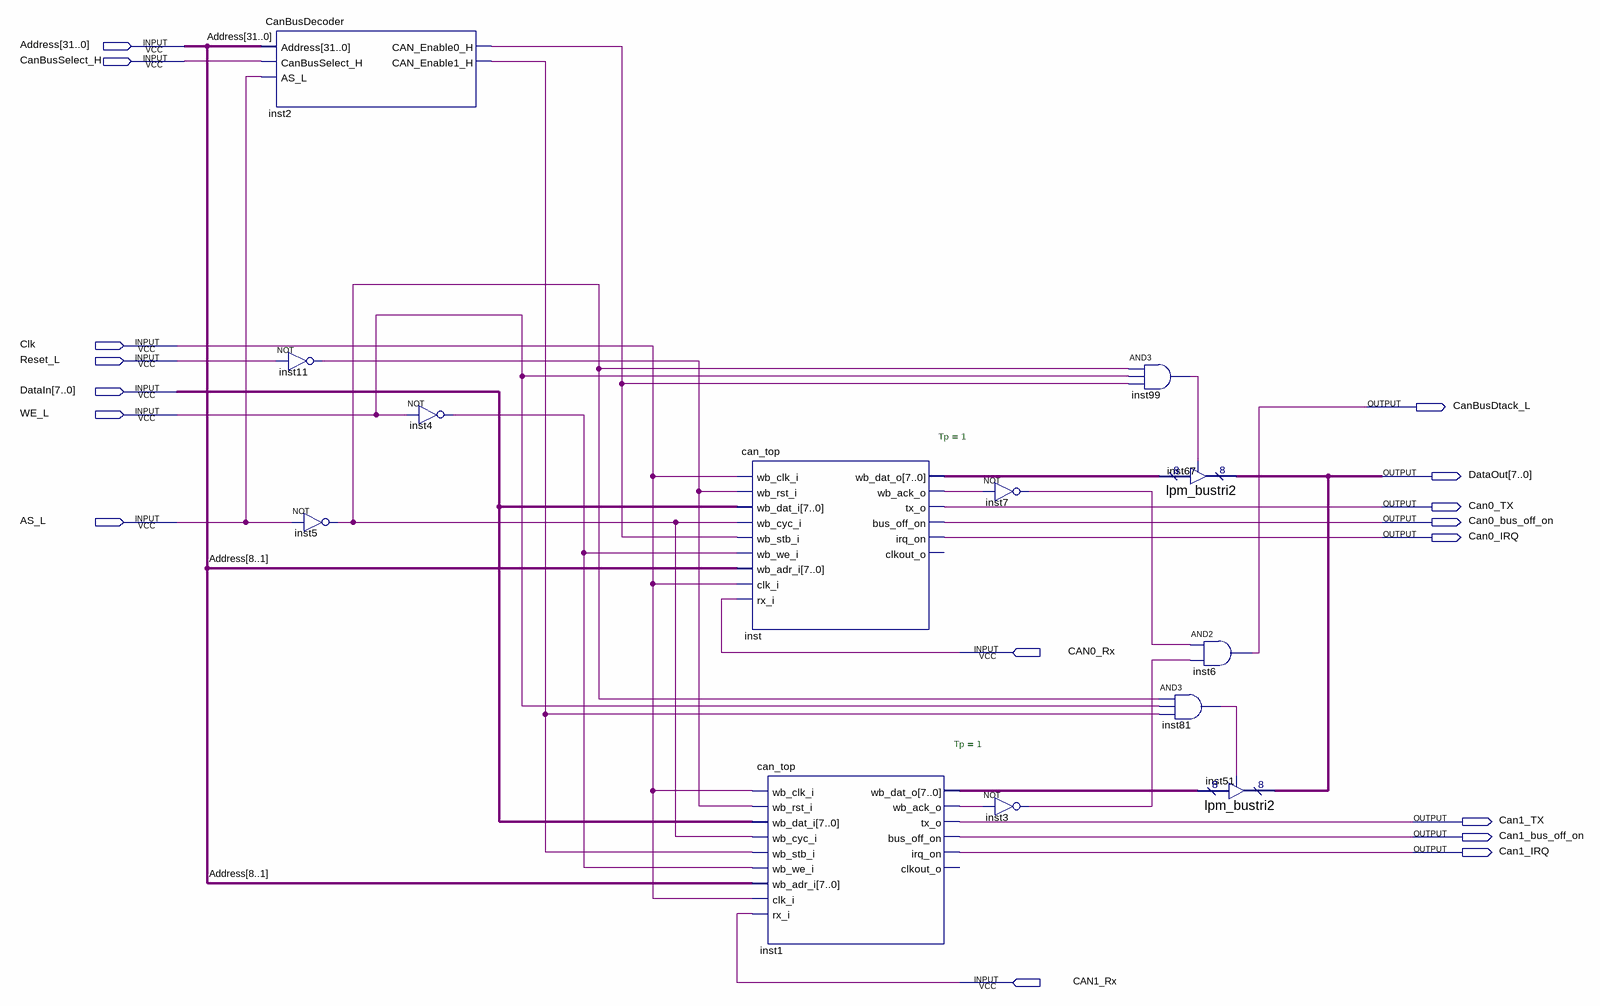
[diagram p0: schematic sheet]
// Quartus schematic CanBus.bdf as structural Verilog: 13 symbols, 17 pins
module CanBus (
  input  [31:0] Address,
  input  CanBusSelect_H,
  input  Clk,
  input  Reset_L,
  input  [7:0] DataIn,
  input  WE_L,
  input  AS_L,
  input  CAN0_Rx,
  input  CAN1_Rx,
  output CanBusDtack_L,
  output [7:0] DataOut,
  output Can0_TX,
  output Can0_bus_off_on,
  output Can0_IRQ,
  output Can1_TX,
  output Can1_bus_off_on,
  output Can1_IRQ
);

  wire inst1_wb_ack_o, inst2_can_enable0_h, inst2_can_enable1_h, inst3_out, inst4_out, inst5_out, inst7_out,
       inst11_out, inst81_out, inst99_out, inst_wb_ack_o;
  wire [7:0] inst1_wb_dat_o, inst_wb_dat_o;

  CanBusDecoder inst2 (
    .Address(Address), .CanBusSelect_H(CanBusSelect_H), .AS_L(AS_L), .CAN_Enable0_H(inst2_can_enable0_h),
    .CAN_Enable1_H(inst2_can_enable1_h));
  not inst11 (inst11_out, Reset_L);
  not inst5 (inst5_out, AS_L);
  not inst4 (inst4_out, WE_L);
  can_top #(.Tp(1)) inst (
    .wb_clk_i(Clk), .wb_rst_i(inst11_out), .wb_dat_i(DataIn), .wb_cyc_i(inst5_out),
    .wb_stb_i(inst2_can_enable0_h), .wb_we_i(inst4_out), .wb_adr_i(Address[8:1]), .clk_i(Clk),
    .rx_i(CAN0_Rx), .wb_dat_o(inst_wb_dat_o), .wb_ack_o(inst_wb_ack_o), .tx_o(Can0_TX),
    .bus_off_on(Can0_bus_off_on), .irq_on(Can0_IRQ));  // open: clkout_o
  can_top #(.Tp(1)) inst1 (
    .wb_clk_i(Clk), .wb_rst_i(inst11_out), .wb_dat_i(DataIn), .wb_cyc_i(inst5_out),
    .wb_stb_i(inst2_can_enable1_h), .wb_we_i(inst4_out), .wb_adr_i(Address[8:1]), .clk_i(Clk),
    .rx_i(CAN1_Rx), .wb_dat_o(inst1_wb_dat_o), .wb_ack_o(inst1_wb_ack_o), .tx_o(Can1_TX),
    .bus_off_on(Can1_bus_off_on), .irq_on(Can1_IRQ));  // open: clkout_o
  not inst7 (inst7_out, inst_wb_ack_o);
  not inst3 (inst3_out, inst1_wb_ack_o);
  and inst99 (inst99_out, inst5_out, WE_L, inst2_can_enable0_h);
  lpm_bustri2 inst67 (.enabledt(inst99_out), .data(inst_wb_dat_o), .tridata(DataOut));
  and inst6 (CanBusDtack_L, inst7_out, inst3_out);
  and inst81 (inst81_out, inst5_out, WE_L, inst2_can_enable1_h);
  lpm_bustri2 inst51 (.enabledt(inst81_out), .data(inst1_wb_dat_o), .tridata(DataOut));
endmodule
